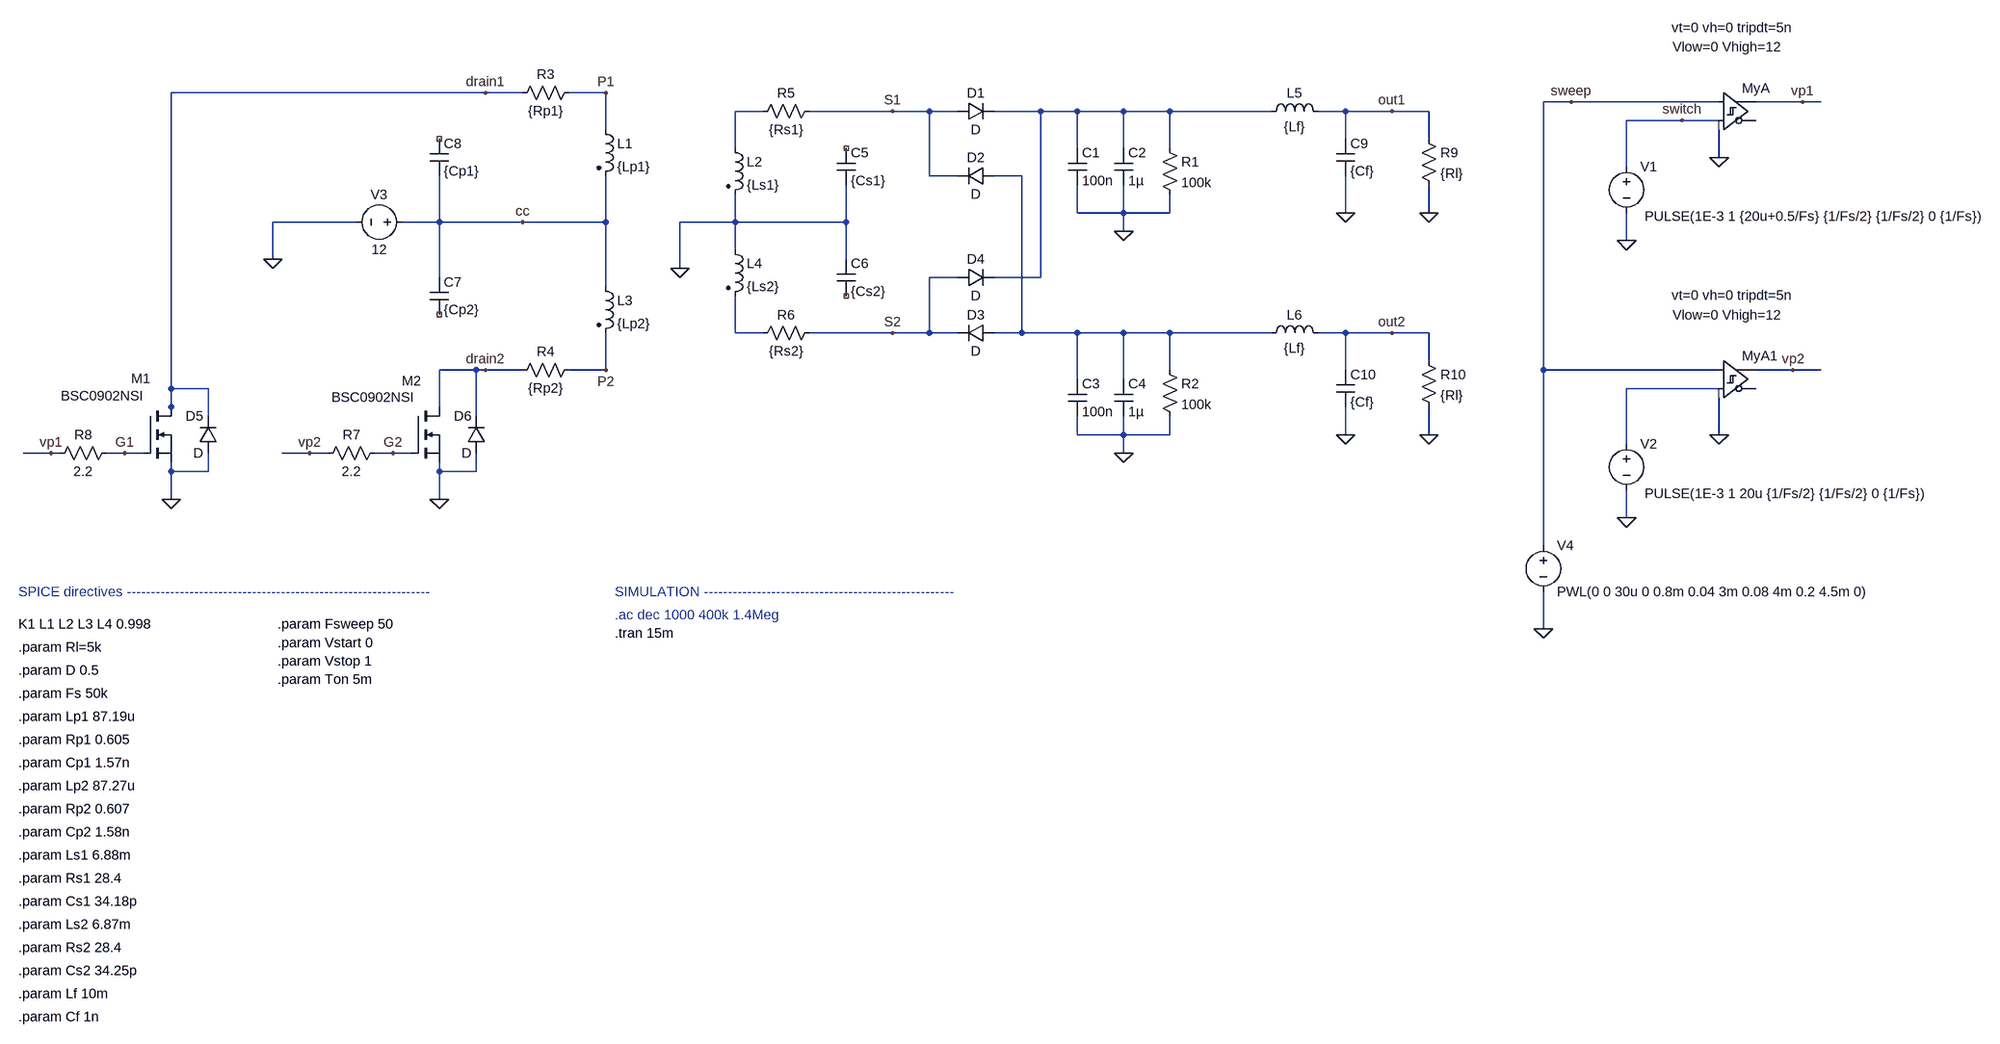
[diagram p0: schematic 5-pwm_mod_bps_v3.asc]
5-pwm_mod_bps_v3.asc, the LTspice schematic file:
Version 4.1
SHEET 1 3244 2276
WIRE 80 656 -464 656
WIRE 144 656 80 656
WIRE 288 656 224 656
WIRE 2128 672 2080 672
WIRE 2384 672 2128 672
WIRE 2528 672 2448 672
WIRE 2560 672 2528 672
WIRE 560 688 512 688
WIRE 784 688 640 688
WIRE 848 688 784 688
WIRE 896 688 848 688
WIRE 1040 688 960 688
WIRE 1104 688 1040 688
WIRE 1184 688 1104 688
WIRE 1264 688 1184 688
WIRE 1440 688 1264 688
WIRE 1568 688 1520 688
WIRE 1648 688 1568 688
WIRE 1712 688 1648 688
WIRE 2320 704 2224 704
WIRE 2384 704 2320 704
WIRE 288 720 288 656
WIRE 1568 736 1568 688
WIRE 1712 736 1712 688
WIRE 512 752 512 688
WIRE 1104 752 1104 688
WIRE 1184 752 1184 688
WIRE 1264 752 1264 688
WIRE 2384 768 2384 720
WIRE 2224 784 2224 704
WIRE 848 800 848 688
WIRE 896 800 848 800
WIRE 1008 800 960 800
WIRE 1104 864 1104 816
WIRE 1184 864 1184 816
WIRE 1184 864 1104 864
WIRE 1264 864 1264 832
WIRE 1264 864 1184 864
WIRE 1568 864 1568 800
WIRE 1712 864 1712 816
WIRE -144 880 -288 880
WIRE 0 880 0 800
WIRE 0 880 -64 880
WIRE 144 880 0 880
WIRE 288 880 288 800
WIRE 288 880 144 880
WIRE 512 880 512 832
WIRE 512 880 416 880
WIRE 704 880 704 816
WIRE 704 880 512 880
WIRE 1184 896 1184 864
WIRE 2224 912 2224 864
WIRE 512 928 512 880
WIRE -288 944 -288 880
WIRE 704 944 704 880
WIRE 416 960 416 880
WIRE 0 976 0 880
WIRE 896 976 848 976
WIRE 1040 976 1040 688
WIRE 1040 976 960 976
WIRE 288 992 288 880
WIRE 512 1072 512 1008
WIRE 560 1072 512 1072
WIRE 784 1072 640 1072
WIRE 848 1072 848 976
WIRE 848 1072 784 1072
WIRE 896 1072 848 1072
WIRE 1008 1072 1008 800
WIRE 1008 1072 960 1072
WIRE 1104 1072 1008 1072
WIRE 1184 1072 1104 1072
WIRE 1264 1072 1184 1072
WIRE 1440 1072 1264 1072
WIRE 1568 1072 1520 1072
WIRE 1648 1072 1568 1072
WIRE 1712 1072 1648 1072
WIRE 1712 1120 1712 1072
WIRE 64 1136 0 1136
WIRE 80 1136 64 1136
WIRE 144 1136 80 1136
WIRE 288 1136 288 1072
WIRE 288 1136 224 1136
WIRE 1264 1136 1264 1072
WIRE 1568 1136 1568 1072
WIRE 2080 1136 2080 672
WIRE 2384 1136 2080 1136
WIRE 2512 1136 2448 1136
WIRE 2560 1136 2512 1136
WIRE 1104 1152 1104 1072
WIRE 1184 1152 1184 1072
WIRE -464 1168 -464 656
WIRE -400 1168 -464 1168
WIRE 2384 1168 2224 1168
WIRE -464 1200 -464 1168
WIRE 0 1200 0 1136
WIRE -464 1216 -464 1200
WIRE -400 1216 -400 1168
WIRE 64 1216 64 1136
WIRE 1104 1248 1104 1216
WIRE 1184 1248 1184 1216
WIRE 1184 1248 1104 1248
WIRE 1264 1248 1264 1216
WIRE 1264 1248 1184 1248
WIRE 1568 1248 1568 1200
WIRE 1712 1248 1712 1200
WIRE 2384 1248 2384 1184
WIRE 2224 1264 2224 1168
WIRE -672 1280 -720 1280
WIRE -656 1280 -672 1280
WIRE -544 1280 -576 1280
WIRE -512 1280 -544 1280
WIRE -224 1280 -272 1280
WIRE -192 1280 -224 1280
WIRE -80 1280 -112 1280
WIRE -48 1280 -80 1280
WIRE 1184 1280 1184 1248
WIRE -464 1312 -464 1296
WIRE -400 1312 -400 1280
WIRE -400 1312 -464 1312
WIRE 0 1312 0 1296
WIRE 64 1312 64 1280
WIRE 64 1312 0 1312
WIRE -464 1360 -464 1312
WIRE 0 1360 0 1312
WIRE 2224 1392 2224 1344
WIRE 2080 1440 2080 1136
WIRE 2080 1584 2080 1520
FLAG 288 656 P1
FLAG 288 1136 P2
FLAG 1184 1280 0
FLAG 1184 896 0
FLAG 416 960 0
FLAG -464 1360 0
FLAG 0 1360 0
FLAG -288 944 0
FLAG 80 656 drain1
FLAG 80 1136 drain2
FLAG -544 1280 G1
FLAG -80 1280 G2
FLAG 144 880 cc
FLAG 1712 864 0
FLAG 1712 1248 0
FLAG 784 688 S1
FLAG 784 1072 S2
FLAG 1568 864 0
FLAG 1568 1248 0
FLAG 2224 912 0
FLAG 2080 1584 0
FLAG 2384 768 0
FLAG 2128 672 sweep
FLAG 2320 704 switch
FLAG -672 1280 vp1
FLAG -224 1280 vp2
FLAG 2528 672 vp1
FLAG 2512 1136 vp2
FLAG 1648 688 out1
FLAG 1648 1072 out2
FLAG 2384 1248 0
FLAG 2224 1392 0
SYMBOL ind2 272 704 R0
SYMATTR InstName L1
SYMATTR Value {Lp1}
SYMATTR Type ind
SYMBOL ind2 496 736 R0
SYMATTR InstName L2
SYMATTR Value {Ls1}
SYMATTR Type ind
SYMBOL ind2 272 976 R0
SYMATTR InstName L3
SYMATTR Value {Lp2}
SYMATTR Type ind
SYMBOL ind2 496 912 R0
SYMATTR InstName L4
SYMATTR Value {Ls2}
SYMATTR Type ind
SYMBOL diode 896 704 R270
WINDOW 0 32 32 VTop 2
WINDOW 3 0 32 VBottom 2
SYMATTR InstName D1
SYMBOL diode 960 784 R90
WINDOW 0 0 32 VBottom 2
WINDOW 3 32 32 VTop 2
SYMATTR InstName D2
SYMBOL diode 960 1056 R90
WINDOW 0 0 32 VBottom 2
WINDOW 3 32 32 VTop 2
SYMATTR InstName D3
SYMBOL diode 896 992 R270
WINDOW 0 32 32 VTop 2
WINDOW 3 0 32 VBottom 2
SYMATTR InstName D4
SYMBOL cap 1088 752 R0
SYMATTR InstName C1
SYMATTR Value 100n
SYMBOL cap 1168 752 R0
SYMATTR InstName C2
SYMATTR Value 1µ
SYMBOL cap 1088 1152 R0
SYMATTR InstName C3
SYMATTR Value 100n
SYMBOL cap 1168 1152 R0
SYMATTR InstName C4
SYMATTR Value 1µ
SYMBOL res 1248 736 R0
SYMATTR InstName R1
SYMATTR Value 100k
SYMBOL res 1248 1120 R0
SYMATTR InstName R2
SYMATTR Value 100k
SYMBOL res 240 640 R90
WINDOW 0 0 56 VBottom 2
WINDOW 3 32 56 VTop 2
SYMATTR InstName R3
SYMATTR Value {Rp1}
SYMBOL res 240 1120 R90
WINDOW 0 0 56 VBottom 2
WINDOW 3 32 56 VTop 2
SYMATTR InstName R4
SYMATTR Value {Rp2}
SYMBOL res 656 672 R90
WINDOW 0 0 56 VBottom 2
WINDOW 3 32 56 VTop 2
SYMATTR InstName R5
SYMATTR Value {Rs1}
SYMBOL res 656 1056 R90
WINDOW 0 0 56 VBottom 2
WINDOW 3 32 56 VTop 2
SYMATTR InstName R6
SYMATTR Value {Rs2}
SYMBOL cap 688 752 R0
SYMATTR InstName C5
SYMATTR Value {Cs1}
SYMBOL cap 688 944 R0
SYMATTR InstName C6
SYMATTR Value {Cs2}
SYMBOL voltage 2224 768 R0
WINDOW 3 31 102 Left 2
WINDOW 123 0 0 Left 0
WINDOW 39 24 46 Left 2
SYMATTR Value PULSE(1E-3 1 {20u+0.5/Fs} {1/Fs/2} {1/Fs/2} 0 {1/Fs})
SYMATTR InstName V1
SYMBOL voltage -48 880 R90
WINDOW 0 -32 56 VBottom 2
WINDOW 3 32 56 VTop 2
WINDOW 123 0 0 Left 0
WINDOW 39 0 0 Left 0
SYMATTR InstName V3
SYMATTR Value 12
SYMBOL nmos -512 1200 R0
WINDOW 0 -21 -49 Left 2
WINDOW 3 -143 -19 Left 2
SYMATTR InstName M1
SYMATTR Value BSC0902NSI
SYMBOL nmos -48 1200 R0
WINDOW 0 -17 -45 Left 2
WINDOW 3 -138 -17 Left 2
SYMATTR InstName M2
SYMATTR Value BSC0902NSI
SYMBOL res -96 1264 R90
WINDOW 0 0 56 VBottom 2
WINDOW 3 32 56 VTop 2
SYMATTR InstName R7
SYMATTR Value 2.2
SYMBOL res -560 1264 R90
WINDOW 0 0 56 VBottom 2
WINDOW 3 32 56 VTop 2
SYMATTR InstName R8
SYMATTR Value 2.2
SYMBOL cap -16 976 R0
SYMATTR InstName C7
SYMATTR Value {Cp2}
SYMBOL cap -16 736 R0
SYMATTR InstName C8
SYMATTR Value {Cp1}
SYMBOL res 1696 720 R0
SYMATTR InstName R9
SYMATTR Value {Rl}
SYMBOL res 1696 1104 R0
SYMATTR InstName R10
SYMATTR Value {Rl}
SYMBOL diode -384 1280 R180
WINDOW 0 24 64 Left 2
WINDOW 3 24 0 Left 2
SYMATTR InstName D5
SYMBOL diode 80 1280 R180
WINDOW 0 24 64 Left 2
WINDOW 3 24 0 Left 2
SYMATTR InstName D6
SYMBOL ind 1424 704 R270
WINDOW 0 32 56 VTop 2
WINDOW 3 5 56 VBottom 2
SYMATTR InstName L5
SYMATTR Value {Lf}
SYMBOL ind 1424 1088 R270
WINDOW 0 32 56 VTop 2
WINDOW 3 5 56 VBottom 2
SYMATTR InstName L6
SYMATTR Value {Lf}
SYMBOL cap 1552 736 R0
SYMATTR InstName C9
SYMATTR Value {Cf}
SYMBOL cap 1552 1136 R0
SYMATTR InstName C10
SYMATTR Value {Cf}
SYMBOL voltage 2080 1424 R0
WINDOW 123 0 0 Left 0
WINDOW 39 0 0 Left 0
SYMATTR InstName V4
SYMATTR Value PWL(0 0 30u 0 0.8m 0.04 3m 0.08 4m 0.2 4.5m 0)
SYMBOL Digital\\diffschmitt 2384 624 R0
WINDOW 3 -82 -81 Left 2
WINDOW 123 -80 -47 Left 2
SYMATTR Value vt=0 vh=0 tripdt=5n
SYMATTR Value2 Vlow=0 Vhigh=12
SYMATTR InstName MyA
SYMBOL Digital\\diffschmitt 2384 1088 R0
WINDOW 3 -82 -81 Left 2
WINDOW 123 -80 -47 Left 2
SYMATTR Value vt=0 vh=0 tripdt=5n
SYMATTR Value2 Vlow=0 Vhigh=12
SYMATTR InstName MyA1
SYMBOL voltage 2224 1248 R0
WINDOW 3 31 102 Left 2
WINDOW 123 0 0 Left 0
WINDOW 39 24 46 Left 2
SYMATTR Value PULSE(1E-3 1 20u {1/Fs/2} {1/Fs/2} 0 {1/Fs})
SYMATTR InstName V2
TEXT -728 1520 Left 2 ;SPICE directives ---------------------------------------------------------------
TEXT 304 1560 Left 2 ;.ac dec 1000 400k 1.4Meg
TEXT 304 1520 Left 2 ;SIMULATION ----------------------------------------------------
TEXT 304 1592 Left 2 !.tran 15m
TEXT -728 1576 Left 2 !K1 L1 L2 L3 L4 0.998
TEXT -728 1736 Left 2 !.param Lp1 87.19u
TEXT -728 1816 Left 2 !.param Cp1 1.57n
TEXT -728 1776 Left 2 !.param Rp1 0.605
TEXT -728 1856 Left 2 !.param Lp2 87.27u
TEXT -728 1936 Left 2 !.param Cp2 1.58n
TEXT -728 1896 Left 2 !.param Rp2 0.607
TEXT -728 1976 Left 2 !.param Ls1 6.88m
TEXT -728 2056 Left 2 !.param Cs1 34.18p
TEXT -728 2016 Left 2 !.param Rs1 28.4
TEXT -728 2096 Left 2 !.param Ls2 6.87m
TEXT -728 2176 Left 2 !.param Cs2 34.25p
TEXT -728 2136 Left 2 !.param Rs2 28.4
TEXT -728 1696 Left 2 !.param Fs 50k
TEXT -728 1656 Left 2 !.param D 0.5
TEXT -728 1616 Left 2 !.param Rl=5k
TEXT -728 2216 Left 2 !.param Lf 10m
TEXT -728 2256 Left 2 !.param Cf 1n
TEXT -280 1576 Left 2 !.param Fsweep 50
TEXT -280 1608 Left 2 !.param Vstart 0
TEXT -280 1640 Left 2 !.param Vstop 1
TEXT -280 1672 Left 2 !.param Ton 5m

The netlist it stands for:
* 5-pwm_mod_bps_v3.asc
L1 P1 cc {Lp1}
L2 N001 0 {Ls1}
L3 cc P2 {Lp2}
L4 0 N004 {Ls2}
D1 S1 N002 D
D2 N003 S1 D
D3 N003 S2 D
D4 S2 N002 D
C1 N002 0 100n
C2 N002 0 1µ
C3 N003 0 100n
C4 N003 0 1µ
R1 N002 0 100k
R2 N003 0 100k
R3 P1 drain1 {Rp1}
R4 P2 drain2 {Rp2}
R5 S1 N001 {Rs1}
R6 S2 N004 {Rs2}
C5 NC_01 0 {Cs1}
C6 0 NC_02 {Cs2}
V1 switch 0 PULSE(1E-3 1 {20u+0.5/Fs} {1/Fs/2} {1/Fs/2} 0 {1/Fs})
V3 cc 0 12
M1 drain1 G1 0 0 BSC0902NSI
M2 drain2 G2 0 0 BSC0902NSI
R7 G2 vp2 2.2
R8 G1 vp1 2.2
C7 cc NC_03 {Cp2}
C8 NC_04 cc {Cp1}
R9 out1 0 {Rl}
R10 out2 0 {Rl}
D5 0 drain1 D
D6 0 drain2 D
L5 N002 out1 {Lf}
L6 N003 out2 {Lf}
C9 out1 0 {Cf}
C10 out2 0 {Cf}
V4 sweep 0 PWL(0 0 30u 0 0.8m 0.04 3m 0.08 4m 0.2 4.5m 0)
A§MyA sweep switch 0 0 0 0 vp1 0 SCHMITT vt=0 vh=0 tripdt=5n Vlow=0 Vhigh=12
A§MyA1 sweep N005 0 0 0 0 vp2 0 SCHMITT vt=0 vh=0 tripdt=5n Vlow=0 Vhigh=12
V2 N005 0 PULSE(1E-3 1 20u {1/Fs/2} {1/Fs/2} 0 {1/Fs})
.model D D
.lib standard.dio
.model NMOS NMOS
.model PMOS PMOS
.lib standard.mos
* SPICE directives ---------------------------------------------------------------
* .ac dec 1000 400k 1.4Meg
* SIMULATION ----------------------------------------------------
.tran 15m
K1 L1 L2 L3 L4 0.998
.param Lp1 87.19u
.param Cp1 1.57n
.param Rp1 0.605
.param Lp2 87.27u
.param Cp2 1.58n
.param Rp2 0.607
.param Ls1 6.88m
.param Cs1 34.18p
.param Rs1 28.4
.param Ls2 6.87m
.param Cs2 34.25p
.param Rs2 28.4
.param Fs 50k
.param D 0.5
.param Rl=5k
.param Lf 10m
.param Cf 1n
.param Fsweep 50
.param Vstart 0
.param Vstop 1
.param Ton 5m
.backanno
.end